# Altium schematic sheet Power.SchDoc
size A4; SheetNumber: 5; SheetTotal: 6
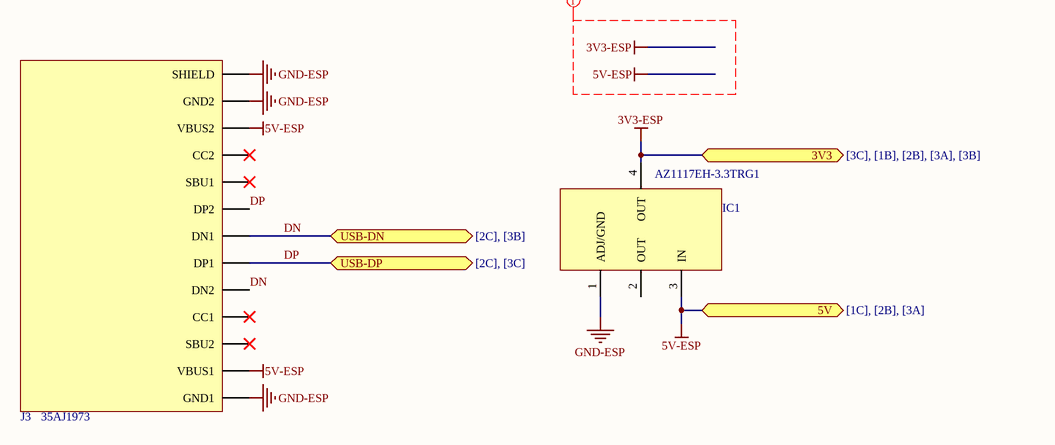
[diagram p0: Power.SchDoc]

## Parts
IC1  MP: AZ1117EH-3.3TRG1  [SOT-223-3-DI]  (hidden comment: Linear Voltage Regulator IC Positive Fixed 1 Output 1A SOT-223-3)
J3  Supplier Part Number: 35AJ1973  [TYPE-C-HOR-RECEPTACLE-24PIN-MOLEX]  (hidden comment: USB-C (USB TYPE-C) USB 2.0 Receptacle Connector 24 (16+8 Dummy) Position Surface Mount, Right Angle; Through Hole)

## Ports
3V3 (bidir, see [3C], [1B], [2B], [3A], [3B]), 5V (bidir, see [1C], [2B], [3A]), USB-DN (bidir, see [2C], [3B]), USB-DP (bidir, see [2C], [3C])

## Nets
3V3-ESP: IC1.4(OUT) ; port 3V3
5V-ESP: IC1.3(IN) J3.A4B9(VBUS1) J3.B4A9(VBUS2) ; port 5V
GND-ESP: IC1.1(ADJ/GND) J3.A1B12(GND1) J3.B1A12(GND2) J3.SHIELD
DN: J3.A7(DN1) J3.B7(DN2) ; port USB-DN
DP: J3.A6(DP1) J3.B6(DP2) ; port USB-DP

Not connected (* = marked no-connect by the designer): IC1 2(OUT); J3 A5(CC1)* A8(SBU1)* B5(CC2)* B8(SBU2)*

## Layout directives
net class POWER: 3V3-ESP, 5V-ESP

## Library data of the parts
IC1 = LDO; 3V3; 1A; SMD; AZ1117EH-3.3TRG1: Linear Voltage Regulator IC 1 Output 1A SOT-223; MF: Diodes Inc.; Designer: TVBac; Package: SOT-223 Diodes Inc.; Value: *; Price: None; SnapEDA_Link: https://www.snapeda.com/parts/AZ1117EH-3.3TRG1/Diodes%20Inc./view-part/482930/?ref=snap; Availability: Unavailable; ComponentLink1Description: Link Digikey; ComponentLink1URL: https://www.digikey.com/en/products/detail/diodes-incorporated/AZ1117EH-3-3TRG1/5001329
J3 = Type-C; USB; HOR; RECEPTACLE;  24PIN; 217179-0001: USB Connector, 16 Contact(s), Female, Right Angle, Surface Mount Terminal, Locking, Receptacle; Manufacturer: Molex; USB Standard: USB 2.0; Current Rating: 1.25A; Number of Contacts: 16; Voltage Rating: 30V; Designer: TVBac; Supplier: Avnet; Manufacturer Part Number: 217179-0001; RoHS: No; Category: Connectors; Stock: 7200; Pricing: 1=1.02, 25=0.853, 100=0.722, 250=0.677, 500=0.631 (USD); Contact Material: Nickel,Gold; Min Operating Temperature: -40°C; Max Operating Temperature: 85°C; Gender: Receptacle; Height: 3.36mm; ComponentLink1Description: Link Digikey; ComponentLink1URL: https://www.digikey.com/en/products/detail/molex/2171790001/13913749